# Altium project dev-board.PrjPcb
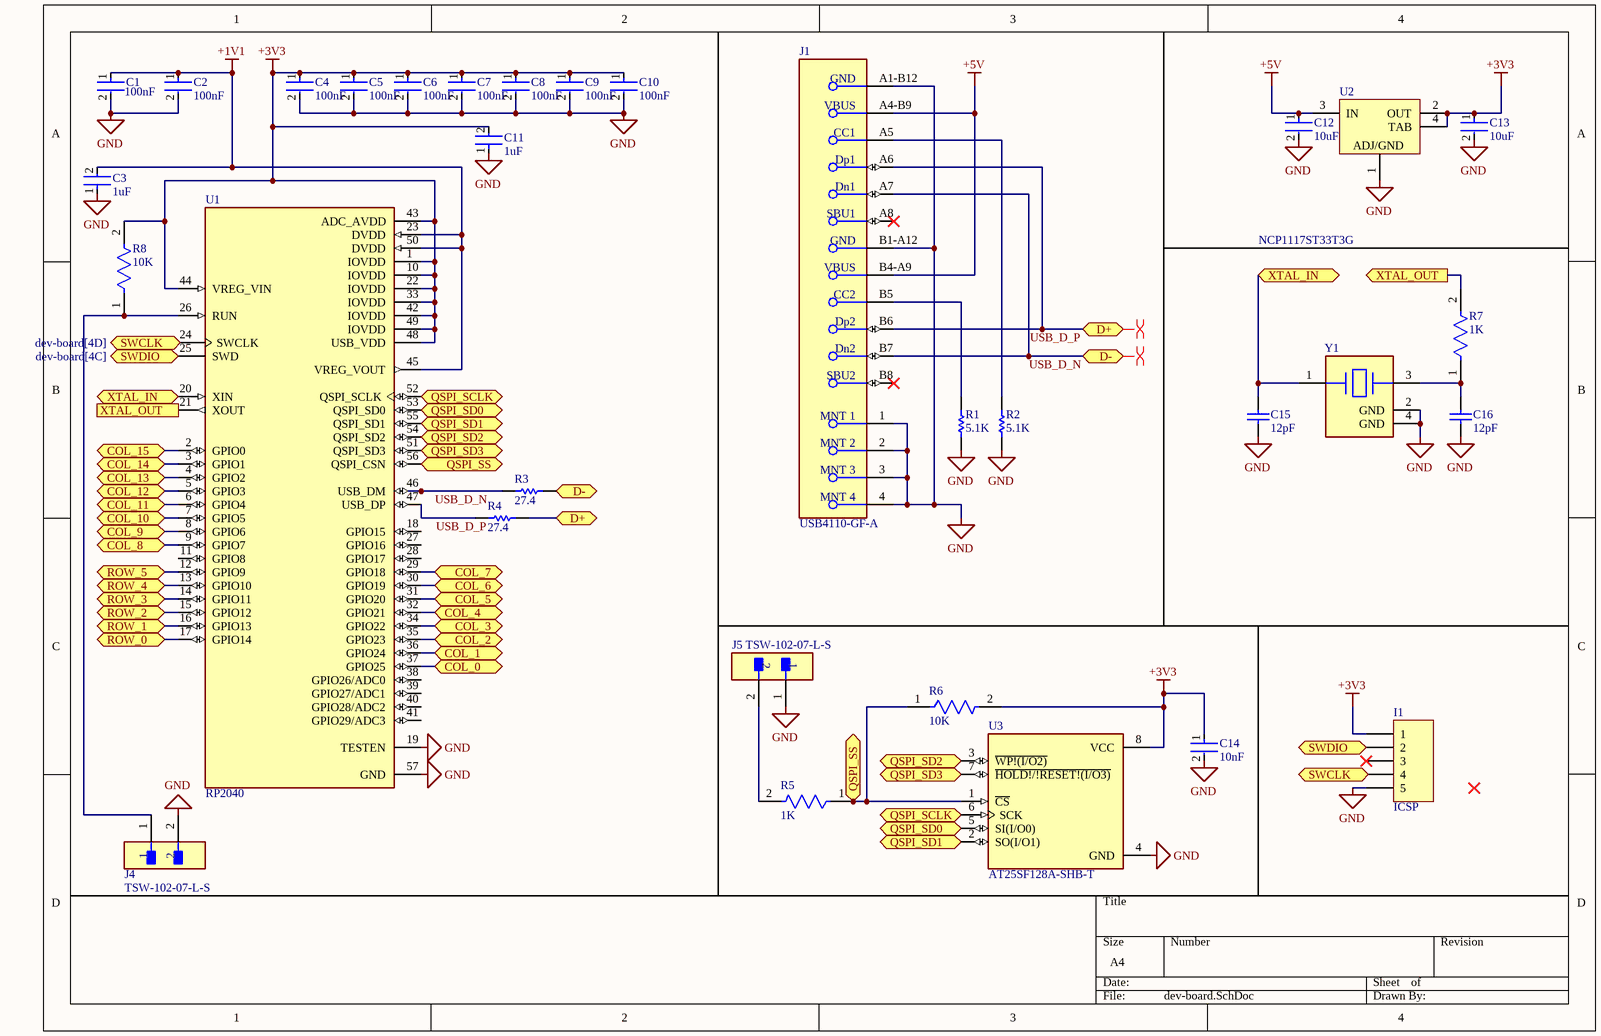
[diagram p0: dev-board.SchDoc]
2 sheets, 200 parts. Net scope: flat (ports and power ports of the same name join across sheets).
Board file: dev-board.PcbDoc
Sheets:
  dev-board.SchDoc
  KeyMatrix.SchDoc

## Sheet dev-board.SchDoc
size A4; SheetNumber: 1; SheetTotal: 2

### Parts
C1  100nF  [FP-CC0603-DA-MFG]
C2  100nF  [FP-CC0603-DA-MFG]
C3  1uF  [FP-CC0603-DA-MFG]
C4  100nF  [FP-CC0603-DA-MFG]
C5  100nF  [FP-CC0603-DA-MFG]
C6  100nF  [FP-CC0603-DA-MFG]
C7  100nF  [FP-CC0603-DA-MFG]
C8  100nF  [FP-CC0603-DA-MFG]
C9  100nF  [FP-CC0603-DA-MFG]
C10  100nF  [FP-CC0603-DA-MFG]
C11  1uF  [FP-CC0603-DA-MFG]
C12  10uF  [FP-CC0603-0_15-0_95-MFG]
C13  10uF  [FP-CC0603-0_15-0_95-MFG]
C14  10nF  [FP-CC0603-DA-MFG]
C15  12pF  [CAPC1608X90X40NL10T20]
C16  12pF  [CAPC1608X90X40NL10T20]
I1  ICSP  [TC2030-MCP-NL]
J1  USB4110-GF-A  [FP-USB4110-GF-A-MFG]
J4  TSW-102-07-L-S  [FP-TSW-102-07-L-S-MFG]
J5  TSW-102-07-L-S  [FP-TSW-102-07-L-S-MFG]
R1  5.1K  [RESC1608X55X25LL10T15]
R2  5.1K  [RESC1608X55X25LL10T15]
R3  27.4  [RESC1608X55X25LL10T15]
R4  27.4  [RESC1608X55X25LL10T15]
R5  1K  [FP-RC0603-0_55-MFG]
R6  10K  [FP-RC0603-0_55-MFG]
R7  1K  [FP-RC0603-0_55-MFG]
R8  10K  [FP-RC0603-0_55-MFG]
U1  RP2040  [QFN40P700X700X90-57N]
U2  NCP1117ST33T3G  [ONSC-SOT-223-4-318H-01_A_V]
U3  AT25SF128A-SHB-T  [SOIC127P790X216-8N]
Y1  (no value)  [FP-ECX-33Q-MFG]

### Ports
COL_0 (bidir, see KeyMatrix[1A]), COL_1 (bidir, see KeyMatrix[2A]), COL_2 (bidir, see KeyMatrix[2A]), COL_3 (bidir, see KeyMatrix[3A]), COL_4 (bidir, see KeyMatrix[3A]), COL_5 (bidir, see KeyMatrix[4A]), COL_6 (bidir, see KeyMatrix[4A]), COL_7 (bidir, see KeyMatrix[5A]), COL_8 (bidir, see KeyMatrix[5A]), COL_9 (bidir, see KeyMatrix[6A]), COL_10 (bidir, see KeyMatrix[6A]), COL_11 (bidir, see KeyMatrix[6A]), COL_12 (bidir, see KeyMatrix[7A]), COL_13 (bidir, see KeyMatrix[7A]), COL_14 (bidir, see KeyMatrix[8A]), COL_15 (bidir, see KeyMatrix[8A]), D+ (bidir, see dev-board[2C]), D+ (bidir, see dev-board[3B]), D- (bidir, see dev-board[2B]), D- (bidir, see dev-board[3B]), QSPI_SCLK (bidir, see dev-board[1B]), QSPI_SCLK (bidir, see dev-board[3D]), QSPI_SD0 (bidir, see dev-board[1B]), QSPI_SD0 (bidir, see dev-board[3D]), QSPI_SD1 (bidir, see dev-board[1B]), QSPI_SD1 (bidir, see dev-board[3D]), QSPI_SD2 (bidir, see dev-board[1B]), QSPI_SD2 (bidir, see dev-board[3C]), QSPI_SD3 (bidir, see dev-board[1B]), QSPI_SD3 (bidir, see dev-board[3D]), QSPI_SS (bidir, see dev-board[1B]), QSPI_SS (bidir, see dev-board[3D]), ROW_0 (bidir, see KeyMatrix[1A]), ROW_1 (bidir, see KeyMatrix[1B]), ROW_2 (bidir, see KeyMatrix[1B]), ROW_3 (bidir, see KeyMatrix[1B]), ROW_4 (bidir, see KeyMatrix[1B]), ROW_5 (bidir, see KeyMatrix[1C]), SWCLK (bidir, see dev-board[1B]), SWCLK (bidir, see dev-board[4D]), SWDIO (bidir, see dev-board[1B]), SWDIO (bidir, see dev-board[4C]), XTAL_IN (bidir, see dev-board[1B]), XTAL_IN (bidir, see dev-board[4B]), XTAL_OUT (out, see dev-board[1B]), XTAL_OUT (out, see dev-board[4B])

### Nets
+1V1: C1.1 C2.1 C3.2 U1.23(DVDD) U1.45(VREG_VOUT) U1.50(DVDD)
+3V3: C4.1 C5.1 C6.1 C7.1 C8.1 C9.1 C10.1 C11.2 C13.1 C14.1 I1.1 R6.2 R8.2 U1.1(IOVDD) U1.10(IOVDD) U1.22(IOVDD) U1.33(IOVDD) U1.42(IOVDD) U1.43(ADC_AVDD) U1.44(VREG_VIN) U1.48(USB_VDD) U1.49(IOVDD) U2.2(OUT) U2.4(TAB) U3.8(VCC)
+5V: C12.1 J1.A4-B9(VBUS) J1.B4-A9(VBUS) U2.3(IN)
GND: C1.2 C2.2 C3.1 C4.2 C5.2 C6.2 C7.2 C8.2 C9.2 C10.2 C11.1 C12.2 C13.2 C14.2 C15.1 C16.1 I1.5 J1.1(MNT_1) J1.2(MNT_2) J1.3(MNT_3) J1.4(MNT_4) J1.A1-B12(GND) J1.B1-A12(GND) J4.2 J5.1 R1.1 R2.1 U1.19(TESTEN) U1.57(GND) U2.1(ADJ/GND) U3.4(GND) Y1.2(GND) Y1.4(GND)
USB_D_N: J1.A7(Dn1) J1.B7(Dn2) R3.1 R3.2 U1.46(USB_DM) ; port D-
USB_D_P: J1.A6(Dp1) J1.B6(Dp2) R4.1 R4.2 U1.47(USB_DP) ; port D+
NetC15_2: C15.2 U1.20(XIN) Y1.1(In/Out) ; port XTAL_IN
NetC16_2: C16.2 R7.1 Y1.3(Out/In)
NetD1_1: U1.17(GPIO14) ; port ROW_0
NetD17_1: U1.16(GPIO13) ; port ROW_1
NetD32_1: U1.15(GPIO12) ; port ROW_2
NetD47_1: U1.14(GPIO11) ; port ROW_3
NetD61_1: U1.13(GPIO10) ; port ROW_4
NetD75_1: U1.12(GPIO9) ; port ROW_5
NetI1_2: I1.2 U1.25(SWD) ; port SWDIO
NetJ1_A5: J1.A5(CC1) R2.2
NetJ1_B5: J1.B5(CC2) R1.2
NetJ4_1: J4.1 R8.1 U1.26(RUN)
NetJ5_2: J5.2 R5.2
NetK1_1: U1.37(GPIO25) ; port COL_0
NetK2_1: U1.36(GPIO24) ; port COL_1
NetK3_1: U1.35(GPIO23) ; port COL_2
NetK4_1: U1.34(GPIO22) ; port COL_3
NetK5_1: U1.32(GPIO21) ; port COL_4
NetK6_1: U1.31(GPIO20) ; port COL_5
NetK7_1: U1.30(GPIO19) ; port COL_6
NetK8_1: U1.29(GPIO18) ; port COL_7
NetK9_1: U1.9(GPIO7) ; port COL_8
NetK10_1: U1.8(GPIO6) ; port COL_9
NetK11_1: U1.7(GPIO5) ; port COL_10
NetK12_1: U1.6(GPIO4) ; port COL_11
NetK13_1: U1.5(GPIO3) ; port COL_12
NetK14_1: U1.4(GPIO2) ; port COL_13
NetK15_1: U1.3(GPIO1) ; port COL_14
NetK16_1: U1.2(GPIO0) ; port COL_15
NetR5_1: R5.1 R6.1 U1.56(QSPI_CSN) U3.1(~{CS}) ; port QSPI_SS
NetR7_2: R7.2 U1.21(XOUT) ; port XTAL_OUT
NetU1_51: U1.51(QSPI_SD3) U3.7(~{HOLD!/!RESET!(I/O3)}) ; port QSPI_SD3
NetU1_52: U1.52(QSPI_SCLK) U3.6(SCK) ; port QSPI_SCLK
NetU1_53: U1.53(QSPI_SD0) U3.5(SI(I/O0)) ; port QSPI_SD0
NetU1_54: U1.54(QSPI_SD2) U3.3(~{WP!(I/O2)}) ; port QSPI_SD2
NetU1_55: U1.55(QSPI_SD1) U3.2(SO(I/O1)) ; port QSPI_SD1

Not connected (* = marked no-connect by the designer): I1 3* 4; J1 A8(SBU1)* B8(SBU2)*; U1 11(GPIO8) 18(GPIO15) 24(SWCLK) 27(GPIO16) 28(GPIO17) 38(GPIO26/ADC0) 39(GPIO27/ADC1) 40(GPIO28/ADC2) 41(GPIO29/ADC3)

### Layout directives
differential pair: USB_D_N, USB_D_P

### Library data of the parts
C1 C2 C4-C10 = CMP-03422-001490-1: CAP CER 0.1UF 50V X7R 0603; Tolerance: 5%; Number of Pins: 2; Depth: 0.8mm; Weight: 7.1E-05oz; Radiation Hardening: No; Capacitance: 100nF; Case Code (Metric): 1608; Dielectric: X7R; Max Operating Temperature: 125°C; Voltage Rating (DC): 50V; Case/Package: 0603; Halogen Free: Halogen Free; Mount: Surface Mount; Lead Free: Lead Free; Termination: SMD/SMT; RoHS Compliant: Yes; Length: 1.6mm; Series: CC; Resistor Type: Ceramic; Case Code (Imperial): 0603; Construction: Flat; Width: 0.031inch; Height: 0.8mm; Voltage Rating: 50V; Min Operating Temperature: -55°C; Thickness: 0.035inch; Packaging: Tape and Reel
C3 C11 = CMP-1035-02737-2: CAP CER 1UF 16V X5R 0603; Manufacturer Part Number: CC0603KRX5R7BB105; Manufacturer: YAGEO; Material: Ceramic; Temperature Coefficient: 15%; Tolerance: 0.1; Digikey Description: CAP CER 1UF 16V X5R 0603; Category: Cap; Automotive: No; Octopart: https://octopart.com/cc0603krx5r7bb105-yageo-8376530; Voltage Rating: 16 V; Device Class L3: Ceramic Capacitors; Value: 1 uF; Temperature Characteristic: X5R; Voltage: 16 V; RoHS: TRUE; Lead Free: Yes; Temperature: -55°C to +125°C; Device Class L2: Capacitors; ComponentLink2URL: http://www.yageo.com/documents/recent/UPY-GPHC_X7R_6.3V-to-50V_18.pdf; Capacitance: 1 uF; Footprint Url: http://www.yageo.com/exep/pages/download/literatures/UPY-C_GEN_24.pdf; Height: 0.9mm; ComponentLink2Description: Datasheet; Temperature Range High: +125°C; Mouser Description: Multilayer Ceramic Capacitors MLCC - SMD/SMT 1.0uF 16V X5R 10%; Package: CC0603-DA; Device Class L1: Passive Components; Temperature Range Low: -55°C
C12 C13 = CMP-03422-001506-1: CAP CER 10UF 6.3V X5R 0603; Tolerance: 20%; Voltage: 4V; Depth: 0.8mm; Halogen Free: Halogen Free; Case Code (Metric): 1608; Height: 0.8mm; Voltage Rating (DC): 6.3V; Construction: Flat; Series: CC; Lead Free: Lead Free; Min Operating Temperature: -55°C; Capacitance: 10uF; Thickness: 0.035inch; Max Operating Temperature: 85°C; Termination: SMD/SMT; Length: 1.6mm; Resistor Type: Ceramic; Dielectric: X5R; Mount: Surface Mount; Width: 0.031inch; Case/Package: 0603; Packaging: Tape and Reel; Case Code (Imperial): 0603; Voltage Rating: 6.3V; Weight: 7.1E-05oz; Radiation Hardening: No; RoHS Compliant: Yes
C14 = CMP-2100-03600-2: CAP CER 10000PF 50V X7R 0603; Manufacturer Part Number: CC0603KRX7R9BB103; Manufacturer: YAGEO; Tolerance: 0.1; Material: Ceramic; Temperature Coefficient: 15%; Mouser Description: Multilayer Ceramic Capacitor, CC Series, 0.01 - F, - 10%, X7R, 50 V, 0603 [1608 Metric]; Digikey Description: CAP CER 10000PF 50V X7R 0603; Height: 0.9mm; Category: Cap; Temperature Characteristic: X7R; Footprint Url: http://www.yageo.com/exep/pages/download/literatures/UPY-C_GEN_24.pdf; Lead Free: Yes; Voltage Rating: 50 V; Temperature: -55°C to +125°C; Device Class L3: Ceramic Capacitors; ComponentLink2Description: Datasheet; Voltage: 50 V; Package: CC0603-DA; Octopart: https://octopart.com/cc0603krx7r9bb103-yageo-192938; Automotive: No; Temperature Range High: +125°C; Temperature Range Low: -55°C; Value: 10 nF; RoHS: TRUE; Device Class L1: Passive Components; ComponentLink2URL: http://www.yageo.com/documents/recent/UPY-GPHC_X7R_6.3V-to-50V_18.pdf; Device Class L2: Capacitors; Capacitance: 10 nF
C15 C16 = CMP-1659-00031-1: Chip Capacitor, 12 pF, +/- 5%, 50 V, -55 to 125 degC, 0603 (1608 Metric), RoHS, Tape and Reel; Tolerance: 1%; Voltage Rating: 250 V; Case\Package: Axial; Power Rating: 250 mW; Resistance: 475 kohm; Mount: Through Hole; Length: 0.248 inch; PackageReference: 0603; DatasheetVersion: Rev. 14, 07/2016; Packaging: Bulk; Max Operating Temperature: 155 degC; Min Operating Temperature: -55 degC; ComponentLink2Description: Datasheet; ComponentLink2URL: http://www.yageo.com/NewPortal/yageodocoutput?fileName=/pdf/MLCC/UPY-GP_NP0_16V-to-50V_14.pdf; ComponentLink1URL: http://www.yageo.com/; PackageDescription: 2-Pin Surface Mount Device, Body 1.6 x 0.8 mm; Package Quantity: 200; RoHSCompliant: true; ComponentLink1Description: Manufacturer URL
J1 = CMP-245163-000002-1: CONN USB 2.0 TYPE-C R/A SMT; Manufacturer: GCT; Conn Orientation: Right Angle; Usb Standard: USB 2.0; Voltage Rating: 20V; Current Rating: 3/4.25/1.25/0.25A; Number Of Contacts: 16; Is Female: yes; Shielding: true; Standoff Height: 0.1mm; Octopart: https://octopart.com/usb4110-gf-a-gct-103941985; Temperature: -40°C to +85°C; RoHS: TRUE; Automotive: No; Contact Material: Gold,Nickel; Device Class L1: Connectors; Device Class L2: USB Connectors; Package: 0; Lead Free: Yes; ComponentLink2URL: https://gct.co/files/drawings/usb4110.pdf; Temperature Range High: +85°C; Temperature Range Low: -40°C; Height: 3.46mm; Manufacturer Part Number: USB4110-GF-A; ComponentLink2Description: Datasheet; Device Class L3: unset; Digikey Description: CONN USB 2.0 TYPE-C R/A SMT; Category: Conn
J4 J5 = CMP-02766-001428-1: CONN HEADER VERT 2POS 2.54MM; Voltage Rating: 550V; Current Rating: 7.6A; Gender: Male; Number of Contacts: 2; Connector Type: Male Pin; Radiation Hardening: No; Orientation: Straight; Contact Plating: Gold; Max Operating Temperature: 125°C; Mount: Through Hole; Package Quantity: 1; Number of Rows: 1; Housing Material: Polyester; RoHS Compliant: Yes; Length: 5.08mm; Max Voltage Rating (AC): 550V; Pitch: 2.54mm; Packaging: Bulk; Depth: 2.54mm; Termination: Solder; Min Operating Temperature: -55°C; Housing Color: Black; Lead Free: Lead Free; Color: Black; Number of Positions: 2; Width: 2.54mm; Max Current Rating: 7.6A; REACH SVHC: No SVHC; Contact Material: Bronze; Contact Mating Length: 0.23inch; Series: TSW; Contact Type: Male Pin
R1 R2 = CMP-2000-04091-1: Manufacturer: Yageo; Part Number: RC0603FR-075K1L
R3 R4 = CMP-2000-06933-1: Chip Resistor, 27 KOhm, +/- 1%, 0.1 W, -55 to 155 degC, 0603 (1608 Metric), RoHS, Tape and Reel; Manufacturer: Yageo; Resistance: 27kOhms; Temperature Coefficient: 100PPM/C; Power Rating: 100mW; Voltage Rating: 50V; Mounting Technology: SurfaceMount; Operating Temperature Range: -55Cto+155C; Case Code - in: 0603; Product: ThickFilmResistorsGeneralPurpose; Package Reference: 0603; Datasheet Version: Rev. 7, 05/2017; Tolerance: 1%; Manufacturer URL: http://www.yageo.com/; Termination Style: SMD/SMT; Packaging: Reel; Series: RC; Package Description: 2-Pin Surface Mount Device, Body 1.6 x 0.8 mm; Datasheet URL: http://www.yageo.com/documents/recent/PYu-RC_Group_51_RoHS_L_7.pdf; Case Code - mm: 1608
R5 R7 = CMP-1659-00009-5: RES 1K OHM 1% 1/10W 0603; Resistance: 1kR; Voltage Rating: 50V; Power Rating: 100mW; Temperature Coefficient: 100ppm/°C; Military Standard: Not; REACH SVHC: No SVHC; Size Code: 0603; Features: Moisture Resistant; Number of Terminations: 2; Technology: THICK FILM; Series: RC; Case Code (Metric): 1608; Resistance Tolerance: 1%; Resistor Type: Thick Film; Termination: SMD/SMT; Contact Plating: Tin; Radiation Hardening: No; Min Operating Temperature: -55°C; Max Operating Temperature: 155°C; Packaging: Tape and Reel; Max Power Dissipation: 100mW; RoHS Compliant: Yes; Height: 0.45mm; Lead Free: Lead Free; Case/Package: 0603; Length: 1.6mm; Tolerance: 1%; Case Code (Imperial): 0603; Construction: Rectangular; Depth: 0.8mm
R6 R8 = CMP-2100-03664-2: RES 10K OHM 1% 1/10W 0603; Voltage Rating: 75V; Voltage Rating (DC): 50V; Resistance: 10kR; Power Rating: 100mW; Temperature Coefficient: 100ppm/°C; Depth: 0.8mm; Termination: SMD/SMT; Resistor Type: Thick Film; Series: RC; Construction: Rectangular; Features: Moisture Resistant; Packaging: Tape and Reel; Min Operating Temperature: -55°C; Number of Terminations: 2; Lead Pitch: 0.3mm; RoHS Compliant: Yes; Case/Package: 0603; Resistance Tolerance: 1%; Military Standard: Not; Weight: 7.1E-05oz; Number of Pins: 2; Tolerance: 1%; Length: 1.6mm; Case Code (Imperial): 0603; Lead Free: Lead Free; Width: 0.8mm; Max Power Dissipation: 100mW; Height: 0.45mm; Max Operating Temperature: 155°C; Case Code (Metric): 1608; Size Code: 0603
U1 = RP2040: RP2040 chip for Raspberry Pi Pico - ARMÂ® CortexÂ®-M0+ MCU 32-Bit; SnapEDA_Link: https://www.snapeda.com/parts/RP2040/Raspberry+Pi/view-part/?ref=snap; Value: *; Purchase-URL: https://pricing.snapeda.com/search/part/RP2040/?ref=eda; MP: RP2040; Availability: In Stock; Check_prices: https://www.snapeda.com/parts/RP2040/Raspberry+Pi/view-part/?ref=eda; Package: None; MF: Raspberry Pi; Price: None
U2 = CMP-1679-00010-1: Low-Dropout Positive Fixed Voltage Regulator, 1 A, 3.3 V Output Voltage, 0 to 125 degC, 4-Pin SOT-223 (318H-01), Pb-Free, Tape and Reel; Resistance: 220 kohm; Type (Resistor): Thick Film; Voltage Rating: 75 V; Tolerance: 1%; Case\Package: 0603; Power Rating: 100 mW; Width: 0.85 mm; Weight: 7.1E-05 oz; ComponentLink2URL: http://www.onsemi.com/pub_link/Collateral/NCP1117-D.PDF; RoHSCompliant: true; Height: 0.45 mm; PackageDescription: 4-Pin Small Outline Transistor, Body 6.5 x 3.5 mm, Pitch 2.3 mm; ComponentLink1Description: Manufacturer URL; ComponentLink1URL: http://www.onsemi.com/; PackageReference: SOT-223-4-318H-01_A; Max Operating Temperature: 155 degC; Packaging: Tape and Reel; REACH SVHC: Unknown; Length: 1.55 mm; Package Quantity: 5000; Radiation Hardening: No; Min Operating Temperature: -55 degC; DatasheetVersion: Rev. 27, 09/2014; Mount: Surface Mount; Case Code (Imperial): 0603; Case Code (Metric): 1608; ComponentLink2Description: Datasheet
U3 = AT25SF128A-SHB-T: 128 Mbit Serial NOR Flash Memory with Dual and Quad I/O Support; MF: Dialog Semiconductor; Value: *; Purchase-URL: https://pricing.snapeda.com/search/part/AT25SF128A-SHB-T/?ref=eda; Package: SOIC-8 Dialog Semiconductor; MP: AT25SF128A-SHB-T; Check_prices: https://www.snapeda.com/parts/AT25SF128A-SHB-T/Dialog%20Semiconductor/view-part/5488499/?ref=eda; SnapEDA_Link: https://www.snapeda.com/parts/AT25SF128A-SHB-T/Dialog%20Semiconductor/view-part/5488499/?ref=snap; Price: None; Availability: Warning
Y1 = CMP-40224-000015-1: CRYSTAL 12.000MHZ 12PF SMD; Frequency: 12MHz; ESR (Equivalent Series Resistance): 100R; Frequency Tolerance: 20ppm; Frequency Stability: 50ppm; Ratings: AEC-Q200; Case/Package: SMD/SMT; Load Capacitance: 12pF; Packaging: Tape and Reel; Max Operating Temperature: 125°C; Width: 0.098inch; Min Operating Temperature: -40°C; Mount: Surface Mount; Length: 0.126inch; Height: 0.031inch

## Sheet KeyMatrix.SchDoc
size A3; SheetNumber: 2; SheetTotal: 2
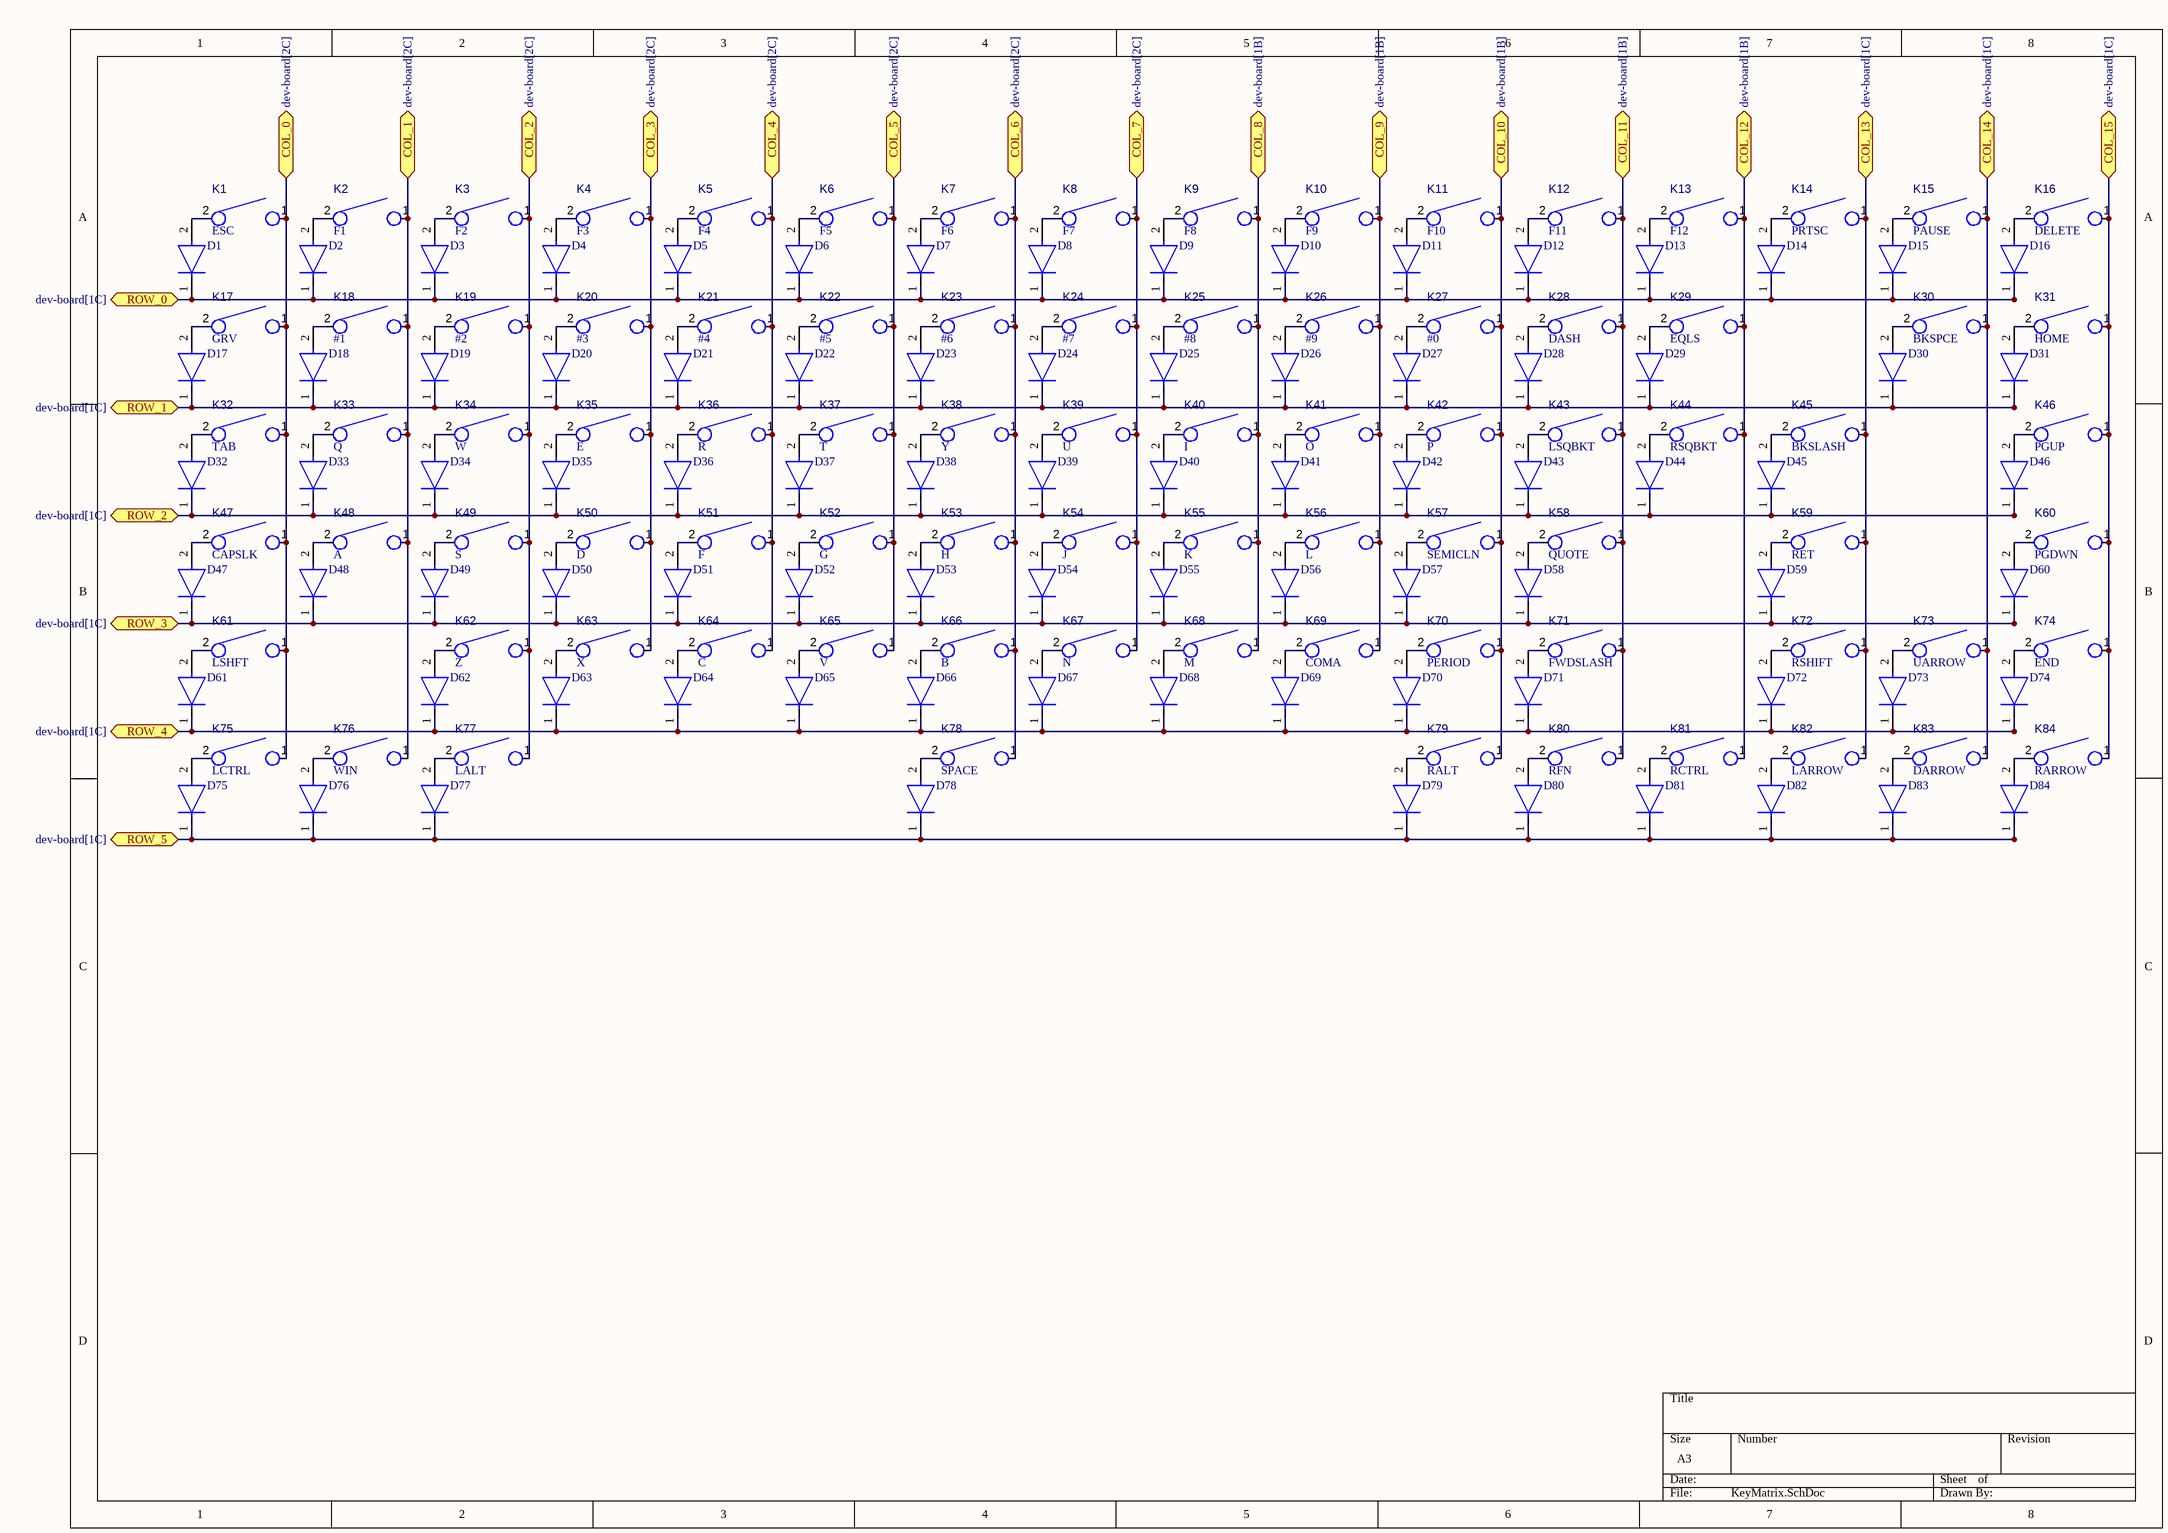
[diagram p1: KeyMatrix.SchDoc]

### Parts
D1  (no value)  [FP-SOD-123-IPC_A]
D2  (no value)  [FP-SOD-123-IPC_A]
D3  (no value)  [FP-SOD-123-IPC_A]
D4  (no value)  [FP-SOD-123-IPC_A]
D5  (no value)  [FP-SOD-123-IPC_A]
D6  (no value)  [FP-SOD-123-IPC_A]
D7  (no value)  [FP-SOD-123-IPC_A]
D8  (no value)  [FP-SOD-123-IPC_A]
D9  (no value)  [FP-SOD-123-IPC_A]
D10  (no value)  [FP-SOD-123-IPC_A]
D11  (no value)  [FP-SOD-123-IPC_A]
D12  (no value)  [FP-SOD-123-IPC_A]
D13  (no value)  [FP-SOD-123-IPC_A]
D14  (no value)  [FP-SOD-123-IPC_A]
D15  (no value)  [FP-SOD-123-IPC_A]
D16  (no value)  [FP-SOD-123-IPC_A]
D17  (no value)  [FP-SOD-123-IPC_A]
D18  (no value)  [FP-SOD-123-IPC_A]
D19  (no value)  [FP-SOD-123-IPC_A]
D20  (no value)  [FP-SOD-123-IPC_A]
D21  (no value)  [FP-SOD-123-IPC_A]
D22  (no value)  [FP-SOD-123-IPC_A]
D23  (no value)  [FP-SOD-123-IPC_A]
D24  (no value)  [FP-SOD-123-IPC_A]
D25  (no value)  [FP-SOD-123-IPC_A]
D26  (no value)  [FP-SOD-123-IPC_A]
D27  (no value)  [FP-SOD-123-IPC_A]
D28  (no value)  [FP-SOD-123-IPC_A]
D29  (no value)  [FP-SOD-123-IPC_A]
D30  (no value)  [FP-SOD-123-IPC_A]
D31  (no value)  [FP-SOD-123-IPC_A]
D32  (no value)  [FP-SOD-123-IPC_A]
D33  (no value)  [FP-SOD-123-IPC_A]
D34  (no value)  [FP-SOD-123-IPC_A]
D35  (no value)  [FP-SOD-123-IPC_A]
D36  (no value)  [FP-SOD-123-IPC_A]
D37  (no value)  [FP-SOD-123-IPC_A]
D38  (no value)  [FP-SOD-123-IPC_A]
D39  (no value)  [FP-SOD-123-IPC_A]
D40  (no value)  [FP-SOD-123-IPC_A]
D41  (no value)  [FP-SOD-123-IPC_A]
D42  (no value)  [FP-SOD-123-IPC_A]
D43  (no value)  [FP-SOD-123-IPC_A]
D44  (no value)  [FP-SOD-123-IPC_A]
D45  (no value)  [FP-SOD-123-IPC_A]
D46  (no value)  [FP-SOD-123-IPC_A]
D47  (no value)  [FP-SOD-123-IPC_A]
D48  (no value)  [FP-SOD-123-IPC_A]
D49  (no value)  [FP-SOD-123-IPC_A]
D50  (no value)  [FP-SOD-123-IPC_A]
D51  (no value)  [FP-SOD-123-IPC_A]
D52  (no value)  [FP-SOD-123-IPC_A]
D53  (no value)  [FP-SOD-123-IPC_A]
D54  (no value)  [FP-SOD-123-IPC_A]
D55  (no value)  [FP-SOD-123-IPC_A]
D56  (no value)  [FP-SOD-123-IPC_A]
D57  (no value)  [FP-SOD-123-IPC_A]
D58  (no value)  [FP-SOD-123-IPC_A]
D59  (no value)  [FP-SOD-123-IPC_A]
D60  (no value)  [FP-SOD-123-IPC_A]
D61  (no value)  [FP-SOD-123-IPC_A]
D62  (no value)  [FP-SOD-123-IPC_A]
D63  (no value)  [FP-SOD-123-IPC_A]
D64  (no value)  [FP-SOD-123-IPC_A]
D65  (no value)  [FP-SOD-123-IPC_A]
D66  (no value)  [FP-SOD-123-IPC_A]
D67  (no value)  [FP-SOD-123-IPC_A]
D68  (no value)  [FP-SOD-123-IPC_A]
D69  (no value)  [FP-SOD-123-IPC_A]
D70  (no value)  [FP-SOD-123-IPC_A]
D71  (no value)  [FP-SOD-123-IPC_A]
D72  (no value)  [FP-SOD-123-IPC_A]
D73  (no value)  [FP-SOD-123-IPC_A]
D74  (no value)  [FP-SOD-123-IPC_A]
D75  (no value)  [FP-SOD-123-IPC_A]
D76  (no value)  [FP-SOD-123-IPC_A]
D77  (no value)  [FP-SOD-123-IPC_A]
D78  (no value)  [FP-SOD-123-IPC_A]
D79  (no value)  [FP-SOD-123-IPC_A]
D80  (no value)  [FP-SOD-123-IPC_A]
D81  (no value)  [FP-SOD-123-IPC_A]
D82  (no value)  [FP-SOD-123-IPC_A]
D83  (no value)  [FP-SOD-123-IPC_A]
D84  (no value)  [FP-SOD-123-IPC_A]
K1  ESC  [Mx_Alps_100]
K2  F1  [Mx_Alps_100]
K3  F2  [Mx_Alps_100]
K4  F3  [Mx_Alps_100]
K5  F4  [Mx_Alps_100]
K6  F5  [Mx_Alps_100]
K7  F6  [Mx_Alps_100]
K8  F7  [Mx_Alps_100]
K9  F8  [Mx_Alps_100]
K10  F9  [Mx_Alps_100]
K11  F10  [Mx_Alps_100]
K12  F11  [Mx_Alps_100]
K13  F12  [Mx_Alps_100]
K14  PRTSC  [Mx_Alps_100]
K15  PAUSE  [Mx_Alps_100]
K16  DELETE  [Mx_Alps_100]
K17  GRV  [Mx_Alps_100]
K18  #1  [Mx_Alps_100]
K19  #2  [Mx_Alps_100]
K20  #3  [Mx_Alps_100]
K21  #4  [Mx_Alps_100]
K22  #5  [Mx_Alps_100]
K23  #6  [Mx_Alps_100]
K24  #7  [Mx_Alps_100]
K25  #8  [Mx_Alps_100]
K26  #9  [Mx_Alps_100]
K27  #0  [Mx_Alps_100]
K28  DASH  [Mx_Alps_100]
K29  EQLS  [Mx_Alps_100]
K30  BKSPCE  [Mx_Alps_200]
K31  HOME  [Mx_Alps_100]
K32  TAB  [Mx_Alps_150]
K33  Q  [Mx_Alps_100]
K34  W  [Mx_Alps_100]
K35  E  [Mx_Alps_100]
K36  R  [Mx_Alps_100]
K37  T  [Mx_Alps_100]
K38  Y  [Mx_Alps_100]
K39  U  [Mx_Alps_100]
K40  I  [Mx_Alps_100]
K41  O  [Mx_Alps_100]
K42  P  [Mx_Alps_100]
K43  LSQBKT  [Mx_Alps_100]
K44  RSQBKT  [Mx_Alps_100]
K45  BKSLASH  [Mx_Alps_150]
K46  PGUP  [Mx_Alps_100]
K47  CAPSLK  [Mx_Alps_175]
K48  A  [Mx_Alps_100]
K49  S  [Mx_Alps_100]
K50  D  [Mx_Alps_100]
K51  F  [Mx_Alps_100]
K52  G  [Mx_Alps_100]
K53  H  [Mx_Alps_100]
K54  J  [Mx_Alps_100]
K55  K  [Mx_Alps_100]
K56  L  [Mx_Alps_100]
K57  SEMICLN  [Mx_Alps_100]
K58  QUOTE  [Mx_Alps_100]
K59  RET  [Mx_Alps_225]
K60  PGDWN  [Mx_Alps_100]
K61  LSHFT  [Mx_Alps_225]
K62  Z  [Mx_Alps_100]
K63  X  [Mx_Alps_100]
K64  C  [Mx_Alps_100]
K65  V  [Mx_Alps_100]
K66  B  [Mx_Alps_100]
K67  N  [Mx_Alps_100]
K68  M  [Mx_Alps_100]
K69  COMA  [Mx_Alps_100]
K70  PERIOD  [Mx_Alps_100]
K71  FWDSLASH  [Mx_Alps_100]
K72  RSHIFT  [Mx_Alps_175]
K73  UARROW  [Mx_Alps_100]
K74  END  [Mx_Alps_100]
K75  LCTRL  [Mx_Alps_125]
K76  WIN  [Mx_Alps_125]
K77  LALT  [Mx_Alps_125]
K78  SPACE  [Mx_Alps_625]
K79  RALT  [Mx_Alps_100]
K80  RFN  [Mx_Alps_100]
K81  RCTRL  [Mx_Alps_100]
K82  LARROW  [Mx_Alps_100]
K83  DARROW  [Mx_Alps_100]
K84  RARROW  [Mx_Alps_100]

### Ports
COL_0 (bidir, see dev-board[2C]), COL_1 (bidir, see dev-board[2C]), COL_2 (bidir, see dev-board[2C]), COL_3 (bidir, see dev-board[2C]), COL_4 (bidir, see dev-board[2C]), COL_5 (bidir, see dev-board[2C]), COL_6 (bidir, see dev-board[2C]), COL_7 (bidir, see dev-board[2C]), COL_8 (bidir, see dev-board[1B]), COL_9 (bidir, see dev-board[1B]), COL_10 (bidir, see dev-board[1B]), COL_11 (bidir, see dev-board[1B]), COL_12 (bidir, see dev-board[1B]), COL_13 (bidir, see dev-board[1C]), COL_14 (bidir, see dev-board[1C]), COL_15 (bidir, see dev-board[1C]), ROW_0 (bidir, see dev-board[1C]), ROW_1 (bidir, see dev-board[1C]), ROW_2 (bidir, see dev-board[1C]), ROW_3 (bidir, see dev-board[1C]), ROW_4 (bidir, see dev-board[1C]), ROW_5 (bidir, see dev-board[1C])

### Nets
NetD1_1: D1.1(C) D2.1(C) D3.1(C) D4.1(C) D5.1(C) D6.1(C) D7.1(C) D8.1(C) D9.1(C) D10.1(C) D11.1(C) D12.1(C) D13.1(C) D14.1(C) D15.1(C) D16.1(C) ; port ROW_0
NetD1_2: D1.2(A) K1.2
NetD2_2: D2.2(A) K2.2
NetD3_2: D3.2(A) K3.2
NetD4_2: D4.2(A) K4.2
NetD5_2: D5.2(A) K5.2
NetD6_2: D6.2(A) K6.2
NetD7_2: D7.2(A) K7.2
NetD8_2: D8.2(A) K8.2
NetD9_2: D9.2(A) K9.2
NetD10_2: D10.2(A) K10.2
NetD11_2: D11.2(A) K11.2
NetD12_2: D12.2(A) K12.2
NetD13_2: D13.2(A) K13.2
NetD14_2: D14.2(A) K14.2
NetD15_2: D15.2(A) K15.2
NetD16_2: D16.2(A) K16.2
NetD17_1: D17.1(C) D18.1(C) D19.1(C) D20.1(C) D21.1(C) D22.1(C) D23.1(C) D24.1(C) D25.1(C) D26.1(C) D27.1(C) D28.1(C) D29.1(C) D30.1(C) D31.1(C) ; port ROW_1
NetD17_2: D17.2(A) K17.2
NetD18_2: D18.2(A) K18.2
NetD19_2: D19.2(A) K19.2
NetD20_2: D20.2(A) K20.2
NetD21_2: D21.2(A) K21.2
NetD22_2: D22.2(A) K22.2
NetD23_2: D23.2(A) K23.2
NetD24_2: D24.2(A) K24.2
NetD25_2: D25.2(A) K25.2
NetD26_2: D26.2(A) K26.2
NetD27_2: D27.2(A) K27.2
NetD28_2: D28.2(A) K28.2
NetD29_2: D29.2(A) K29.2
NetD30_2: D30.2(A) K30.2
NetD31_2: D31.2(A) K31.2
NetD32_1: D32.1(C) D33.1(C) D34.1(C) D35.1(C) D36.1(C) D37.1(C) D38.1(C) D39.1(C) D40.1(C) D41.1(C) D42.1(C) D43.1(C) D44.1(C) D45.1(C) D46.1(C) ; port ROW_2
NetD32_2: D32.2(A) K32.2
NetD33_2: D33.2(A) K33.2
NetD34_2: D34.2(A) K34.2
NetD35_2: D35.2(A) K35.2
NetD36_2: D36.2(A) K36.2
NetD37_2: D37.2(A) K37.2
NetD38_2: D38.2(A) K38.2
NetD39_2: D39.2(A) K39.2
NetD40_2: D40.2(A) K40.2
NetD41_2: D41.2(A) K41.2
NetD42_2: D42.2(A) K42.2
NetD43_2: D43.2(A) K43.2
NetD44_2: D44.2(A) K44.2
NetD45_2: D45.2(A) K45.2
NetD46_2: D46.2(A) K46.2
NetD47_1: D47.1(C) D48.1(C) D49.1(C) D50.1(C) D51.1(C) D52.1(C) D53.1(C) D54.1(C) D55.1(C) D56.1(C) D57.1(C) D58.1(C) D59.1(C) D60.1(C) ; port ROW_3
NetD47_2: D47.2(A) K47.2
NetD48_2: D48.2(A) K48.2
NetD49_2: D49.2(A) K49.2
NetD50_2: D50.2(A) K50.2
NetD51_2: D51.2(A) K51.2
NetD52_2: D52.2(A) K52.2
NetD53_2: D53.2(A) K53.2
NetD54_2: D54.2(A) K54.2
NetD55_2: D55.2(A) K55.2
NetD56_2: D56.2(A) K56.2
NetD57_2: D57.2(A) K57.2
NetD58_2: D58.2(A) K58.2
NetD59_2: D59.2(A) K59.2
NetD60_2: D60.2(A) K60.2
NetD61_1: D61.1(C) D62.1(C) D63.1(C) D64.1(C) D65.1(C) D66.1(C) D67.1(C) D68.1(C) D69.1(C) D70.1(C) D71.1(C) D72.1(C) D73.1(C) D74.1(C) ; port ROW_4
NetD61_2: D61.2(A) K61.2
NetD62_2: D62.2(A) K62.2
NetD63_2: D63.2(A) K63.2
NetD64_2: D64.2(A) K64.2
NetD65_2: D65.2(A) K65.2
NetD66_2: D66.2(A) K66.2
NetD67_2: D67.2(A) K67.2
NetD68_2: D68.2(A) K68.2
NetD69_2: D69.2(A) K69.2
NetD70_2: D70.2(A) K70.2
NetD71_2: D71.2(A) K71.2
NetD72_2: D72.2(A) K72.2
NetD73_2: D73.2(A) K73.2
NetD74_2: D74.2(A) K74.2
NetD75_1: D75.1(C) D76.1(C) D77.1(C) D78.1(C) D79.1(C) D80.1(C) D81.1(C) D82.1(C) D83.1(C) D84.1(C) ; port ROW_5
NetD75_2: D75.2(A) K75.2
NetD76_2: D76.2(A) K76.2
NetD77_2: D77.2(A) K77.2
NetD78_2: D78.2(A) K78.2
NetD79_2: D79.2(A) K79.2
NetD80_2: D80.2(A) K80.2
NetD81_2: D81.2(A) K81.2
NetD82_2: D82.2(A) K82.2
NetD83_2: D83.2(A) K83.2
NetD84_2: D84.2(A) K84.2
NetK1_1: K1.1 K17.1 K32.1 K47.1 K61.1 K75.1 ; port COL_0
NetK2_1: K2.1 K18.1 K33.1 K48.1 K76.1 ; port COL_1
NetK3_1: K3.1 K19.1 K34.1 K49.1 K62.1 K77.1 ; port COL_2
NetK4_1: K4.1 K20.1 K35.1 K50.1 K63.1 ; port COL_3
NetK5_1: K5.1 K21.1 K36.1 K51.1 K64.1 ; port COL_4
NetK6_1: K6.1 K22.1 K37.1 K52.1 K65.1 ; port COL_5
NetK7_1: K7.1 K23.1 K38.1 K53.1 K66.1 K78.1 ; port COL_6
NetK8_1: K8.1 K24.1 K39.1 K54.1 K67.1 ; port COL_7
NetK9_1: K9.1 K25.1 K40.1 K55.1 K68.1 ; port COL_8
NetK10_1: K10.1 K26.1 K41.1 K56.1 K69.1 ; port COL_9
NetK11_1: K11.1 K27.1 K42.1 K57.1 K70.1 K79.1 ; port COL_10
NetK12_1: K12.1 K28.1 K43.1 K58.1 K71.1 K80.1 ; port COL_11
NetK13_1: K13.1 K29.1 K44.1 K81.1 ; port COL_12
NetK14_1: K14.1 K45.1 K59.1 K72.1 K82.1 ; port COL_13
NetK15_1: K15.1 K30.1 K73.1 K83.1 ; port COL_14
NetK16_1: K16.1 K31.1 K46.1 K60.1 K74.1 K84.1 ; port COL_15

### Library data of the parts
D1-D84 = CMP-2000-04993-2: DIODE GEN PURP 100V 150MA SOD123; Max Reverse Leakage Current: 5uA; Max Surge Current: 2A; Reverse Recovery Time: 4ns; Polarity: Standard; Capacitance: 4pF; Max Forward Surge Current (Ifsm): 1A; Element Configuration: Single; Power Dissipation: 400mW; Forward Voltage: 1V; Radiation Hardening: No; Lead Free: Lead Free; Max Reverse Voltage (DC): 100V; Current Rating: 150mA; Forward Current: 150mA; Packaging: Tape and Reel; Number of Pins: 2; Package Quantity: 3000; Max Operating Temperature: 150°C; Min Operating Temperature: -65°C; Average Rectified Current: 150mA; Recovery Time: 4ns; Output Current: 150mA; Peak Non-Repetitive Surge Current: 2A; Width: 1.8mm; Voltage Rating (DC): 100V; Height: 1.2mm; Max Repetitive Reverse Voltage (Vrrm): 100V; Mount: Surface Mount; Length: 2.85mm
K1-K84 = CMP-006-000013-2: Value: KEYSW; Design Item ID: KEYSW; Source: keyboard_parts.SchLib

## Nets that join several sheets
NetD1_1: dev-board (U1.17), KeyMatrix (16 pins)
NetD17_1: dev-board (U1.16), KeyMatrix (15 pins)
NetD32_1: dev-board (U1.15), KeyMatrix (15 pins)
NetD47_1: dev-board (U1.14), KeyMatrix (14 pins)
NetD61_1: dev-board (U1.13), KeyMatrix (14 pins)
NetD75_1: dev-board (U1.12), KeyMatrix (10 pins)
NetK1_1: dev-board (U1.37), KeyMatrix (6 pins)
NetK2_1: dev-board (U1.36), KeyMatrix (5 pins)
NetK3_1: dev-board (U1.35), KeyMatrix (6 pins)
NetK4_1: dev-board (U1.34), KeyMatrix (5 pins)
NetK5_1: dev-board (U1.32), KeyMatrix (5 pins)
NetK6_1: dev-board (U1.31), KeyMatrix (5 pins)
NetK7_1: dev-board (U1.30), KeyMatrix (6 pins)
NetK8_1: dev-board (U1.29), KeyMatrix (5 pins)
NetK9_1: dev-board (U1.9), KeyMatrix (5 pins)
NetK10_1: dev-board (U1.8), KeyMatrix (5 pins)
NetK11_1: dev-board (U1.7), KeyMatrix (6 pins)
NetK12_1: dev-board (U1.6), KeyMatrix (6 pins)
NetK13_1: dev-board (U1.5), KeyMatrix (K13.1 K29.1 K44.1 K81.1)
NetK14_1: dev-board (U1.4), KeyMatrix (5 pins)
NetK15_1: dev-board (U1.3), KeyMatrix (K15.1 K30.1 K73.1 K83.1)
NetK16_1: dev-board (U1.2), KeyMatrix (6 pins)